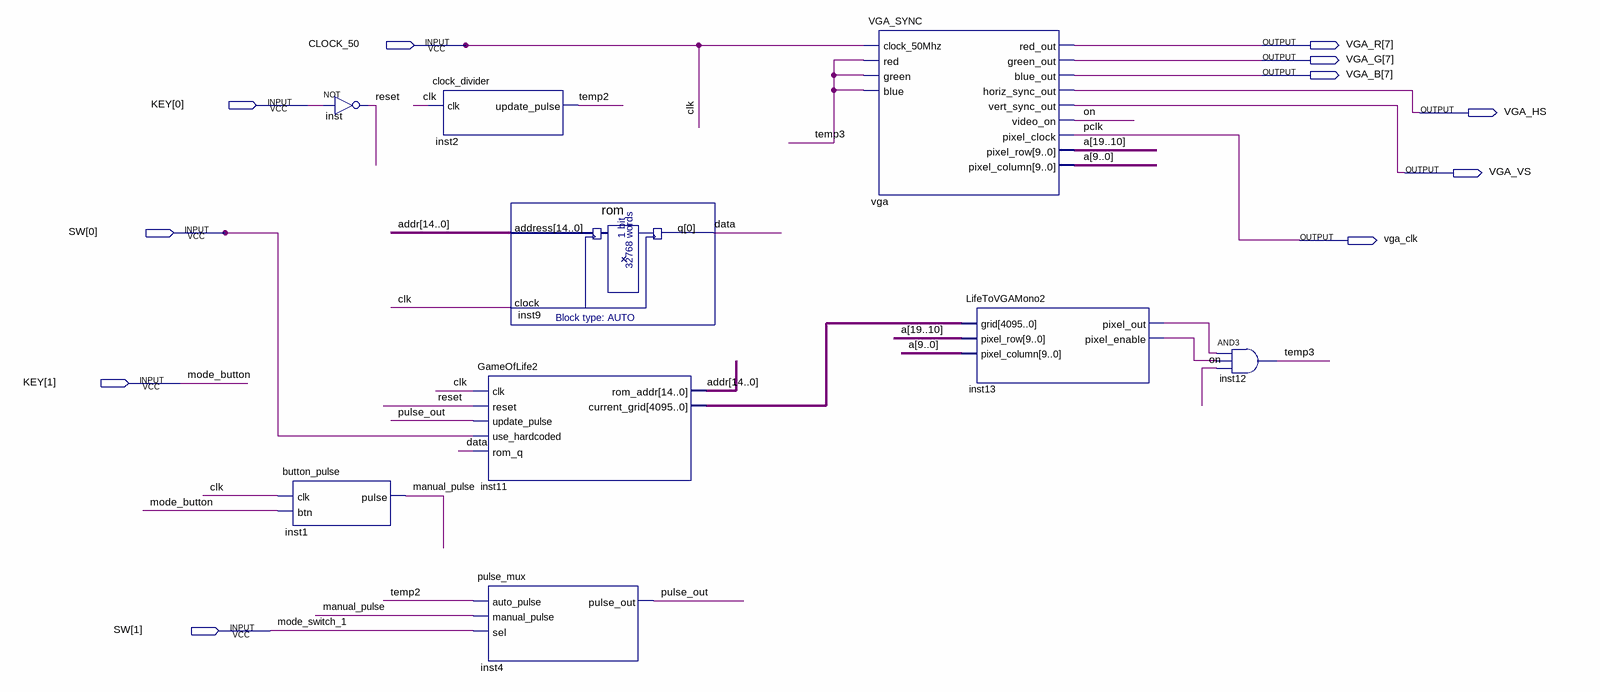
[diagram p0: schematic sheet]
// Quartus schematic vga_filtro.bdf as structural Verilog: 9 symbols, 11 pins
module vga_filtro (
  input  CLOCK_50,
  input  [1:0] KEY,
  input  [1:0] SW,
  output [7:7] VGA_R,
  output [7:7] VGA_G,
  output [7:7] VGA_B,
  output VGA_HS,
  output VGA_VS,
  output vga_clk
);

  wire data, inst13_pixel_enable, inst13_pixel_out, manual_pulse, on, pulse_out, reset, temp2, temp3;
  wire [14:0] addr;
  wire [19:0] a;
  wire [4095:0] inst11_current_grid;

  button_pulse inst1 (.clk(CLOCK_50), .btn(KEY[1]), .pulse(manual_pulse));
  not inst (reset, KEY[0]);
  clock_divider inst2 (.clk(CLOCK_50), .update_pulse(temp2));
  GameOfLife2 inst11 (
    .clk(CLOCK_50), .reset(reset), .update_pulse(pulse_out), .use_hardcoded(SW[0]), .rom_q(data),
    .rom_addr(addr), .current_grid(inst11_current_grid));
  pulse_mux inst4 (.auto_pulse(temp2), .manual_pulse(manual_pulse), .sel(SW[1]), .pulse_out(pulse_out));
  rom inst9 (.address(addr), .clock(CLOCK_50), .q(data));
  VGA_SYNC vga (
    .clock_50Mhz(CLOCK_50), .red(temp3), .green(temp3), .blue(temp3), .red_out(VGA_R[7]),
    .green_out(VGA_G[7]), .blue_out(VGA_B[7]), .horiz_sync_out(VGA_HS), .vert_sync_out(VGA_VS),
    .video_on(on), .pixel_clock(vga_clk), .pixel_row(a[19:10]), .pixel_column(a[9:0]));
  LifeToVGAMono2 inst13 (
    .grid(inst11_current_grid), .pixel_row(a[19:10]), .pixel_column(a[9:0]), .pixel_out(inst13_pixel_out),
    .pixel_enable(inst13_pixel_enable));
  and inst12 (temp3, inst13_pixel_out, inst13_pixel_enable, on);

  // Other names for the same wires on the sheet: clk = CLOCK_50; mode_button = KEY[1]; mode_switch_1 = SW[1];
  //   pclk = vga_clk
endmodule
